# Altium schematic sheet USBHSULPI.SchDoc
size A4; SheetNumber: 7; SheetTotal: 9
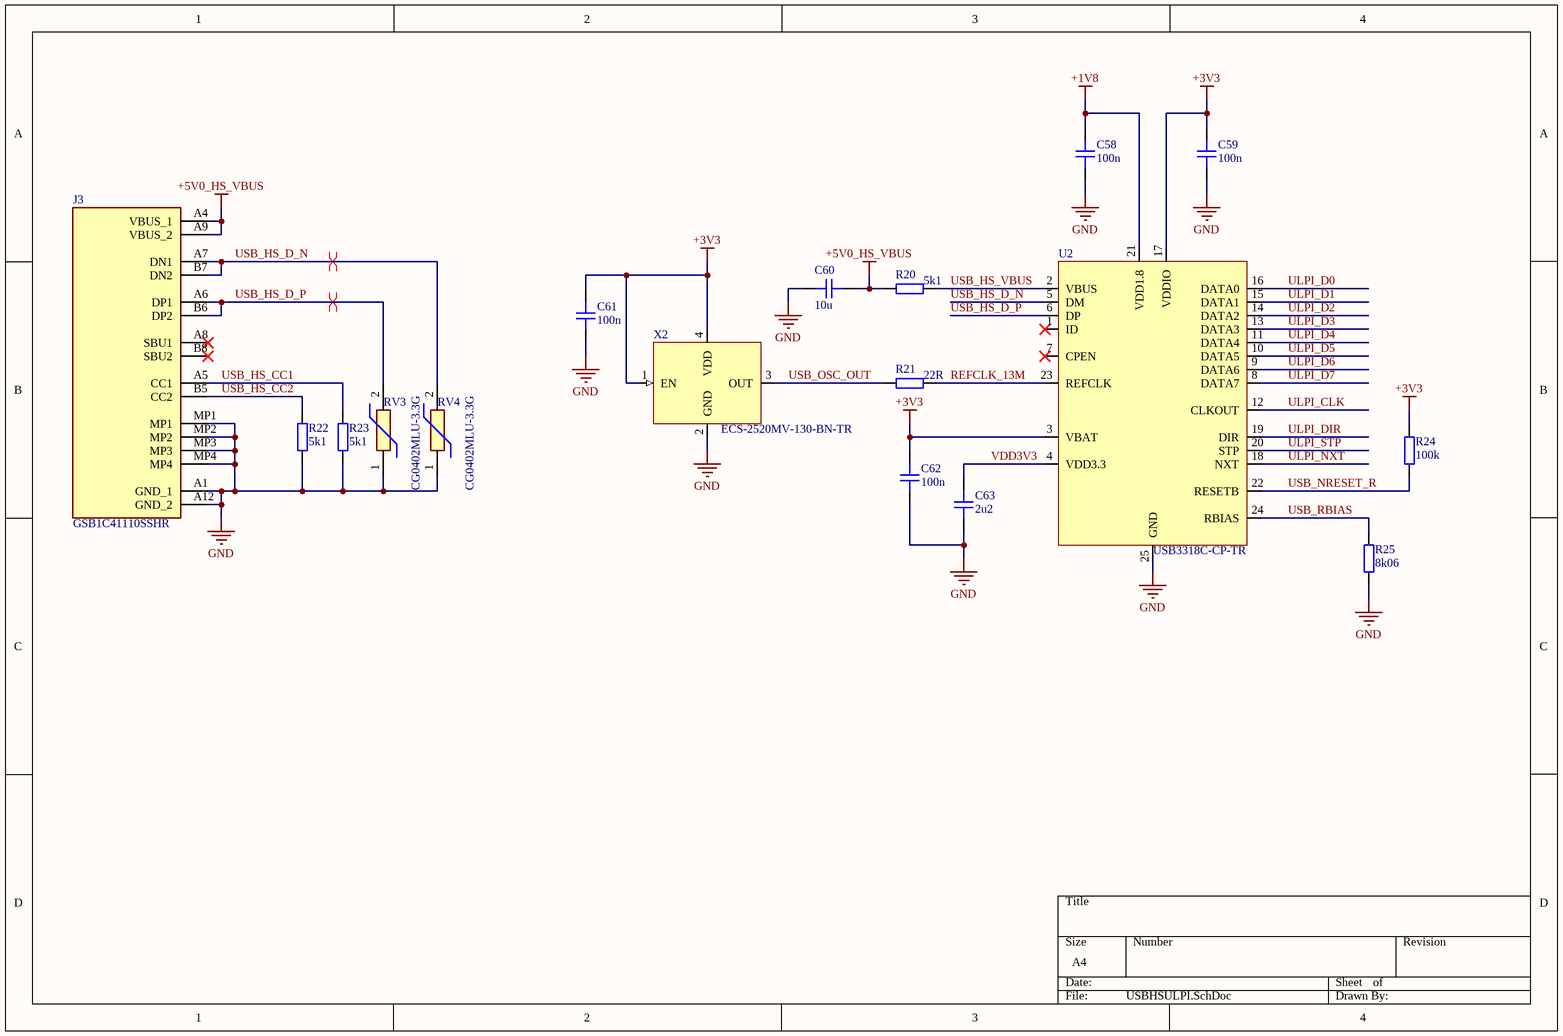
[diagram p0: USBHSULPI.SchDoc]

## Parts
C58  100n  [CAP_0402]
C59  100n  [CAP_0402]
C60  10u  [CAP_0603]
C61  100n  [CAP_0402]
C62  100n  [CAP_0402]
C63  2u2  [CAP_0402]
J3  GSB1C41110SSHR  [GSB1C41110SSHR]
R20  5k1  [RES_0402]
R21  22R  [RES_0402]
R22  5k1  [RES_0402]
R23  5k1  [RES_0402]
R24  100k  [RES_0402]
R25  8k06  [RES_0402]
RV3  CG0402MLU-3.3G  [VARC1005X41N]
RV4  CG0402MLU-3.3G  [VARC1005X41N]
U2  USB3318C-CP-TR  [QFN50P400X400X100-25N-D]
X2  ECS-2520MV-130-BN-TR  [XTAL_2520]

## Nets
+1V8: C58.2 U2.21(VDD1.8)
+3V3: C59.2 C61.2 C62.2 R24.1 U2.3(VBAT) U2.17(VDDIO) X2.1(EN) X2.4(VDD)
+5V0_HS_VBUS: C60.1 J3.A4(VBUS_1) J3.A9(VBUS_2) R20.2
GND: C58.1 C59.1 C60.2 C61.1 C62.1 C63.1 J3.A1(GND_1) J3.A12(GND_2) J3.MP1 J3.MP2 J3.MP3 J3.MP4 R22.2 R23.2 R25.1 RV3.1 RV4.1 U2.25(GND) X2.2(GND)
REFCLK_13M: R21.1 U2.23(REFCLK)
ULPI_CLK: U2.12(CLKOUT)
ULPI_D0: U2.16(DATA0)
ULPI_D1: U2.15(DATA1)
ULPI_D2: U2.14(DATA2)
ULPI_D3: U2.13(DATA3)
ULPI_D4: U2.11(DATA4)
ULPI_D5: U2.10(DATA5)
ULPI_D6: U2.9(DATA6)
ULPI_D7: U2.8(DATA7)
ULPI_DIR: U2.19(DIR)
ULPI_NXT: U2.18(NXT)
ULPI_STP: U2.20(STP)
USB_HS_CC1: J3.A5(CC1) R23.1
USB_HS_CC2: J3.B5(CC2) R22.1
USB_HS_D_N: J3.A7(DN1) J3.B7(DN2) RV4.2 U2.5(DM)
USB_HS_D_P: J3.A6(DP1) J3.B6(DP2) RV3.2 U2.6(DP)
USB_HS_VBUS: R20.1 U2.2(VBUS)
USB_NRESET_R: R24.2 U2.22(RESETB)
USB_OSC_OUT: R21.2 X2.3(OUT)
USB_RBIAS: R25.2 U2.24(RBIAS)
VDD3V3: C63.2 U2.4(VDD3.3)

Not connected (* = marked no-connect by the designer): J3 A8(SBU1)* B8(SBU2)*; U2 1(ID)* 7(CPEN)*

## Layout directives
differential pair: USB_HS_D_N, USB_HS_D_P

## Library data of the parts
C58 C59 C61-C63 = CAP_0402: Capacitor SMD 0402; Manufacturer: *; Manufacturer Part Number: *; Distributor Link: *; LCSC: *; Rating: *; Dielectric: *
C60 = CAP_0603: Capacitor SMD 0603; Manufacturer: *; Manufacturer Part Number: *; Distributor Link: *; LCSC: *; Rating: *; Dielectric: *
J3 = GSB1C41110SSHR: Connector; Manufacturer_Name: Amphenol Communications Solutions; Datasheet Link: https://cdn.amphenol-cs.com/media/wysiwyg/files/drawing/gsb1c41x10sshr-ax1.pdf; Height: 3.41mm; Manufacturer_Part_Number: GSB1C41110SSHR
R20-R25 = RES_0402: Resistor SMD 0402; Manufacturer: *; Manufacturer Part Number: *; Distributor Link: *; LCSC: *
RV3 RV4 = CG0402MLU-3.3G: ESD Diode; Manufacturer_Name: Bourns; Datasheet Link: https://www.bourns.com/docs/Product-Datasheets/MLU.pdf; Height: 0.41mm; Manufacturer_Part_Number: CG0402MLU-3.3G; Mouser Part Number: 652-CG0402MLU-3.3G; Mouser Price/Stock: https://www.mouser.co.uk/ProductDetail/Bourns/CG0402MLU-3.3G?qs=m8myXnDJXpWVM8EQWErxtQ%3D%3D; Arrow Part Number: CG0402MLU-3.3G; Arrow Price/Stock: https://www.arrow.com/en/products/cg0402mlu-3.3g/bourns?utm_currency=USD&region=nac
U2 = USB3318C-CP-TR: USB Interface IC High Speed USB 1.8V ULPI; Manufacturer: Microchip; Manufacturer Part Number: USB3318C-CP-TR
X2 = ECS-2520MV-130-BN-TR: Standard Clock Oscillators XO (Standard),13MHz,Standby (Power Down),CMOS, Multi-Volt,1.6 V 3.6 V,+/-50ppm,-40 C 85 C,6mA,Surface Mount,4-SMD, No Lead,(2.50mm x 2.00mm),(0.80mm); Manufacturer: ECS; Manufacturer Part Number: ECS-2520MV-130-BN-TR